# EAGLE design chlorophyll_analyzer_LEDs (EAGLE 9.4.2)
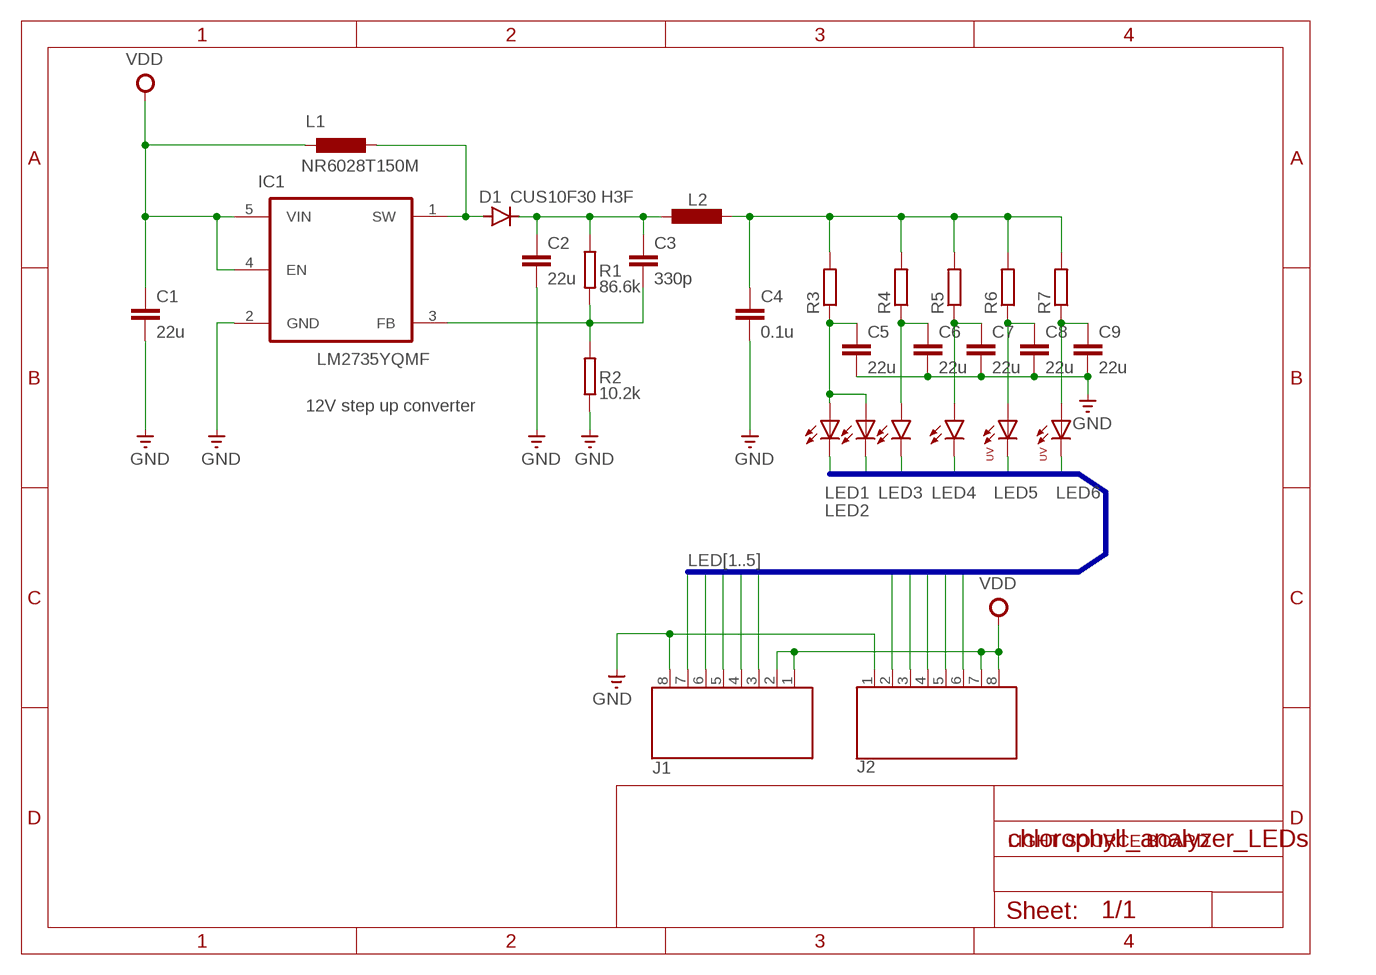
[diagram p0: schematic, sheet 1]

## Parts
C1  22u  C-EUC0603K  [C0603K]
C2  22u  C-EUC0603K  [C0603K]
C3  330p  C-EUC0603K  [C0603K]
C4  0.1u  C-EUC0603K  [C0603K]
C5  22u  C-EUC0603K  [C0603K]
C6  22u  C-EUC0603K  [C0603K]
C7  22u  C-EUC0603K  [C0603K]
C8  22u  C-EUC0603K  [C0603K]
C9  22u  C-EUC0603K  [C0603K]
D1  CUS10F30 H3F  DIODE-SOD323-W  [SOD323-W]
IC1  LM2735YQMF  [SOT65P285X120-5N]
J1  687108183722  [687108183722]
J2  687108183722  [687108183722]
L1  NR6028T150M  [IND_TAIYO_NR6028]
L2  INDUCOR2012  [SMD2012]
LED1  L130-S1S0-3030509506-0000003S-000015080003000W21  L130-5080003000W21  [LED_L130-5080003000W21]
LED2  L130-S1S0-3030509506-0000003S-000015080003000W21  L130-5080003000W21  [LED_L130-5080003000W21]
LED3  LEDCHIPLED_1206  [CHIPLED_1206]
LED4  LEDCHIPLED_1206  [CHIPLED_1206]
LED5  ELUA2016OGB-P8090Q53038020-VA1M  ELUA2016OGB  [ELUA2016OGB0.08]
LED6  ELUA2016OGB-P8090Q53038020-VA1M  ELUA2016OGB  [ELUA2016OGB0.08]
R1  86.6k  RESISTOR1608  [SMD1608]
R2  10.2k  RESISTOR1608  [SMD1608]
R3  R-EU_R0805  [R0805]
R4  R-EU_R0805  [R0805]
R5  R-EU_R0805  [R0805]
R6  R-EU_R0805  [R0805]
R7  R-EU_R0805  [R0805]

## Nets
AVOUT_12V: C4.1 L2.1 R3.2 R4.2 R5.2 R6.2 R7.2
GND: C1.2 C2.2 C4.2 C5.2 C6.2 C7.2 C8.2 C9.2 IC1.2(GND) J1.8 J2.1 R2.1
LED1: J1.3 J2.6 LED1.C LED2.C
LED2: J1.4 J2.5 LED3.C
LED3: J1.5 LED4.C
LED4: J1.6 J2.3 J2.4 LED5.C(C1)
LED5: J1.7 J2.2 LED6.C(C1)
N$1: C5.1 LED1.A LED2.A R3.1
N$2: C6.1 LED3.A R4.1
N$3: C7.1 LED4.A R5.1
N$5: C9.1 LED6.A(A1) R7.1
N$6: C8.1 LED5.A(A1) R6.1
N$7: C2.1 C3.1 D1.C L2.2 R1.2
N$8: D1.A IC1.1(SW) L1.1
N$9: C3.2 IC1.3(FB) R1.1 R2.2
VDD: C1.1 IC1.4(EN) IC1.5(VIN) J1.1 J1.2 J2.7 J2.8 L1.2

## Buses
LED[1..5]

## Notes on the sheet
- 12V step up converter
- LIGHT SOURCE BOARD

## Library data of the parts
C1-C9 = rcl:C-EU: CAPACITOR, European symbol; SPICEPREFIX: C
D1 = diode:DIODE-: DIODE
IC1 = LM2735YQMF:LM2735YQMF: SEPIC DC-DC Regulatoe; AVAILABILITY: Unavailable; DESCRIPTION: 520kHz/1.6MHz - Space-Efficient Boost and SEPIC DC-DC Regulator 5-SOT-23 -40 to 125; MF: Texas Instruments; MP: LM2735YQMF/NOPB; PACKAGE: SOT-23 Texas Instruments; PRICE: None
J1 J2 = Eagle_FPC_CONNECTOR_AND_FFC_CAB (rev18c):687108183722: 687108183722 WR-FPC 0.50mm SMT Horizontal Bottom Contact - Low Profile <http://katalog.we-online.de/media/images/v2/Family_WR-FPC_6871xx183722.jpg> Details see: http://katalog.we-online.de/en/em/FPC_0_5_SMT_ZIF_HORIZONTAL_BOTTOM_CONTACT_LOW_PROFILE_6871xx183722 Created by Yingchun,shan 2016 (C) Wurth Elektronik
L1 = NR6028T:NR6028T150M; MANUFACTURER_PART_NUMBER: NR6028T150M; VENDOR: TAIYO YUDEN
L2 = Fugu_RCL:INDUCOR
LED1 LED2 = L130-5080003000W21:L130-5080003000W21: 3030 2D 5000K 96 Lumens 80 CRI 120 mA 6.1 V Surface Mount Mid Power LED; AVAILABILITY: Unavailable; DESCRIPTION: 3030 2D 5000K 96 Lumens 80 CRI 120 mA 6.1 V Surface Mount Mid Power LED; MF: Lumileds; MP: L130-5080003000W21; PACKAGE: 1212 Philips Lumileds; PRICE: None
LED3 LED4 = led:LED: LED OSRAM: - CHIPLED LG R971, LG N971, LY N971, LG Q971, LY Q971, LO R971, LY R971 LH N974, LH R974 LS Q976, LO Q976, LY Q976 LO Q996 - Hyper CHIPLED LW Q18S LB Q993, LB Q99A, LB R99A - SideLED LS A670, LO A670, LY A670, LG A670, LP A670 LB A673, LV A673, LT A673, LW A673 LH A674 LY A675 LS A676, LA A676, LO A676, LY A676, LW A676 LS A679, LY A679, LG A679 - Hyper Micro SIDELED® LS Y876, LA Y876, LO Y876, LY Y876 LT Y87S - SmartLED LW L88C, LW L88S LB L89C, LB L89S, LG L890 LS L89K, LO L89K, LY L89K LS L896, LA L896, LO L896, LY L896 - TOPLED LS T670, LO T670, LY T670, LG T670, LP T670 LSG T670, LSP T670, LSY T670, LOP T670, LYG T670 LG T671, LOG T671, LSG T671 LB T673, LV T673, LT T673, LW T673 LH T674 LS T676, LA T676, LO T676, LY T676, LB T676, LH T676, LSB T676, LW T676 LB T67C, LV T67C, LT T67C, LS T67K, LO T67K, LY T67K, LW E67C LS E67B, LA E67B, LO E67B, LY E67B, LB E67C, LV E67C, LT E67C LW T67C LS T679, LY T679, LG T679 LS T770, LO T770, LY T770, LG T770, LP T770 LB T773, LV T773, LT T773, LW T773 LH T774 LS E675, LA E675, LY E675, LS T675 LS T776, LA T776, LO T776, LY T776, LB T776 LHGB T686 LT T68C, LB T68C - Hyper Mini TOPLED® LB M676 - Mini TOPLED Santana® LG M470 LS M47K, LO M47K, LY M47K Source: http://www.osram.convergy.de LUXEON: - LUMILED® LXK2-PW12-R00, LXK2-PW12-S00, LXK2-PW14-U00, LXK2-PW14-V00 LXK2-PM12-R00, LXK2-PM12-S00, LXK2-PM14-U00 LXK2-PE12-Q00, LXK2-PE12-R00, LXK2-PE12-S00, LXK2-PE14-T00, LXK2-PE14-U00 LXK2-PB12-K00, LXK2-PB12-L00, LXK2-PB12-M00, LXK2-PB14-N00, LXK2-PB14-P00, LXK2-PB14-Q00 LXK2-PR12-L00, LXK2-PR12-M00, LXK2-PR14-Q00, LXK2-PR14-R00 LXK2-PD12-Q00, LXK2-PD12-R00, LXK2-PD12-S00 LXK2-PH12-R00, LXK2-PH12-S00 LXK2-PL12-P00, LXK2-PL12-Q00, LXK2-PL12-R00 Source: www.luxeon.com KINGBRIGHT: KA-3528ASYC Source: www.kingbright.com
LED5 LED6 = ELUA2016OGB:ELUA2016OGB: UV LED SMD
R1 R2 = Fugu_RCL:RESISTOR: Generic Registor
R3-R7 = resistor:R-EU_: RESISTOR, European symbol

## Board
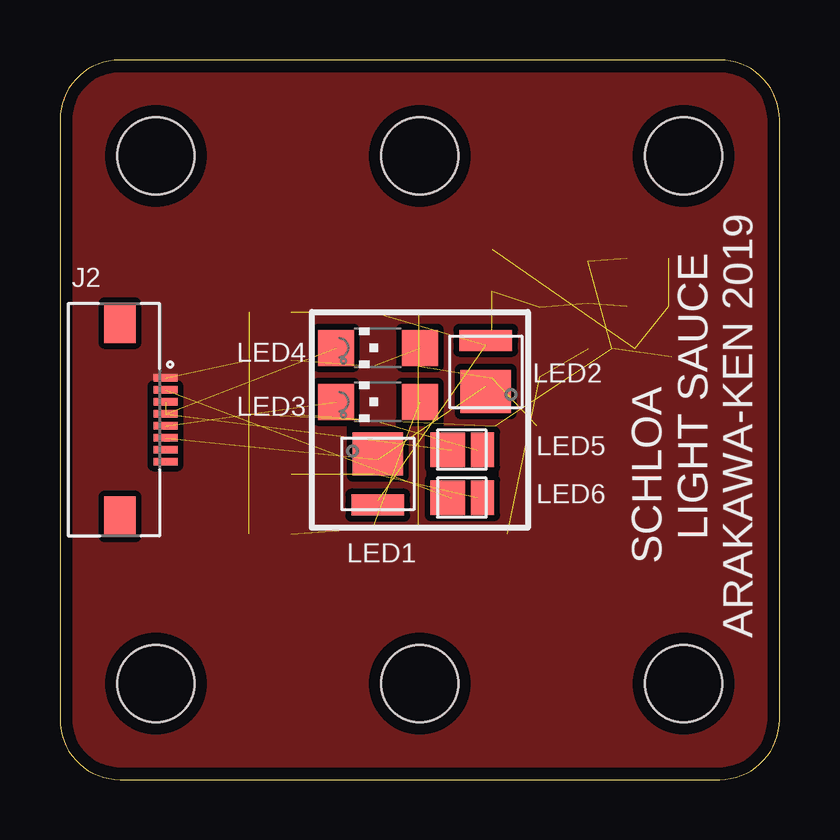
[diagram p1: board, top side]
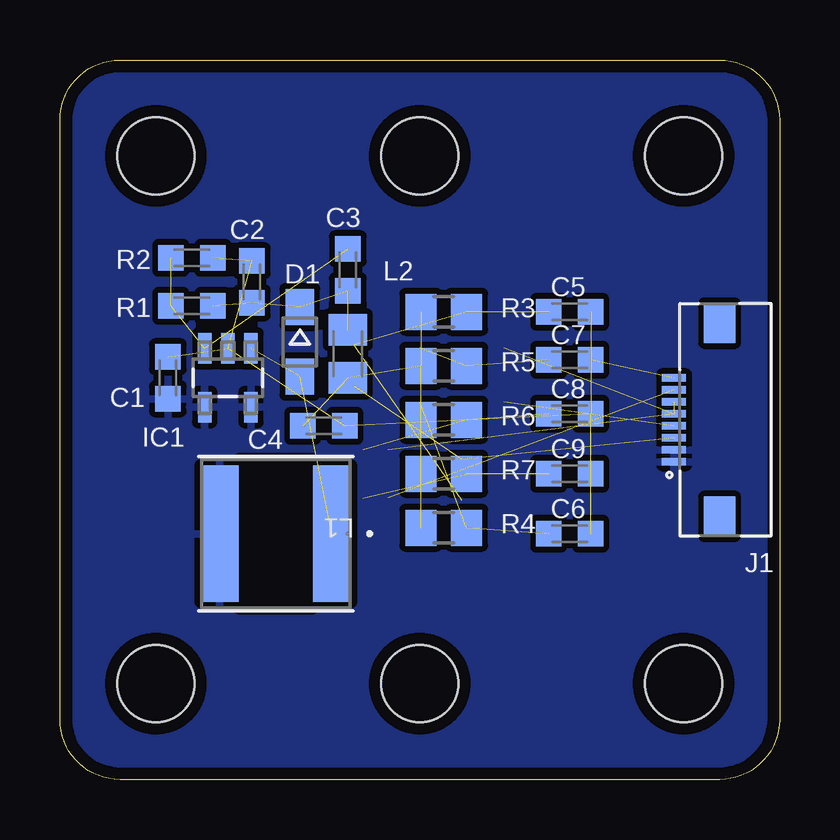
[diagram p2: board, bottom side, seen from below]

Size 30 x 30 mm. Coordinates in mm from the lower left corner, seen from the top.
Outline: 0,27.5 0,2.5 arc90 2.5,0 27.5,0 arc90 30,2.5 30,27.5 arc90 27.5,30 2.5,30 arc90 0,27.5
Copper layers (1*16): Top 0.035mm / dielectric 1.6mm / Bottom 0.035mm
Design rules "Elecrow_2-layer_PCB_eagle_rule": minimum track width 6mil, minimum drill 12mil, track to track 6mil, track to pad 6mil, pad to pad 6mil, via to via 8mil, smd to smd 0mil, copper to edge 20mil, drill to drill 10mil, minimum pad ring 6mil, minimum via ring 6mil, stop-mask expansion 0mil, vias tented up to drill 100mil, thermal gap 10mil
Holes 3.2 mm at 4,4 4,26 26,26 26,4 15,26 15,4

### Footprints (pad centres in the part's own frame; a part is rotated, then mirrored left to right if it is on the bottom)
C0603K = smd 1.05 x 1.08: 1 -0.875,0; 2 0.875,0
SOD323-W = smd 1.5 x 1.2: A 1.45,0; C -1.45,0
SOT65P285X120-5N = smd 1.27 x 0.559: 1 -1.219,0.965; 2 -1.219,0; 3 -1.219,-0.965; 4 1.219,-0.965; 5 1.219,0.965
687108183722 = smd 0.3 x 1: 1 -1.75,1.9; 2 -1.25,1.9; 3 -0.75,1.9; 4 -0.25,1.9; 5 0.25,1.9; 6 0.75,1.9; 7 1.25,1.9; 8 1.75,1.9 | smd 1.65 x 1.3: Z1 -4.025,0; Z2 4.025,0
IND_TAIYO_NR6028 = smd 1.6 x 5.69: 1 -2.349,0; 2 2.349,0
SMD2012 = smd 1.3 x 1.6: 1 -1,0; 2 1,0
LED_L130-5080003000W21 = smd 0.48 x 2.2: A -1.11,0; A1 -1.507,0 | smd 1.33 x 2.1: C 0.585,0; C1 1.061,0
CHIPLED_1206 = smd 1.5 x 1.5: A 0,-1.75; C 0,1.75
ELUA2016OGB0.08 = smd 0.5 x 1.45: A -0.625,0; A1 -1.101,0 | smd 1.1 x 1.45: C 0.425,0; C1 0.743,0
SMD1608 = smd 1.05 x 1.08: 1 -0.875,0; 2 0.875,0
R0805 = smd 1.3 x 1.5: 1 -0.95,0; 2 0.95,0

### Placement (x,y rotation side)
C1  25.5,16.75 90 bottom
C2  22,20.75 90 bottom
C3  18,21.25 90 bottom
C4  19,14.75 0 bottom
C5  8.75,19.5 0 bottom
C6  8.75,10.25 0 bottom
C7  8.75,17.5 0 bottom
C8  8.75,15.25 0 bottom
C9  8.75,12.75 0 bottom
D1  20,18.25 270 bottom
IC1  23,16.75 270 bottom
J1  2.5,15 90 bottom
J2  2.5,15 270 top
L1  21,10.25 180 bottom
L2  18,17.75 90 bottom
LED1  13.25,12.75 90 top
LED2  17.75,17 270 top
LED3  13.25,15.75 90 top
LED4  13.25,18 90 top
LED5  16.75,13.75 180 top
LED6  16.75,11.75 180 top
R1  24.5,19.75 0 bottom
R2  24.5,21.75 180 bottom
R3  14,19.5 180 bottom
R4  14,10.5 180 bottom
R5  14,17.25 180 bottom
R6  14,15 180 bottom
R7  14,12.75 180 bottom

### Tracks (layer width: path | path; a pad name or v marks a point on that pad's centre or on a via)
AVOUT_12V  (6 unrouted)
GND  (11 unrouted)
  pour Top (isolate 0.254, rank 2, no thermals): -2,31 31,31 31,-1 -2,-1
LED1  (3 unrouted)
LED2  (2 unrouted)
LED3  (1 unrouted)
LED4  (3 unrouted)
LED5  (2 unrouted)
N$1  (3 unrouted)
N$2  (2 unrouted)
N$3  (2 unrouted)
N$5  (2 unrouted)
N$6  (2 unrouted)
N$7  (4 unrouted)
N$8  (2 unrouted)
N$9  (3 unrouted)
VDD  (2 unrouted)
  pour Bottom (isolate 0.254, rank 2): -2,31 31,31 31,-1 -2,-1

### Text on the board
tPlace: ARAKAWA-KEN 2019 | SCHLOA / LIGHT SAUCE